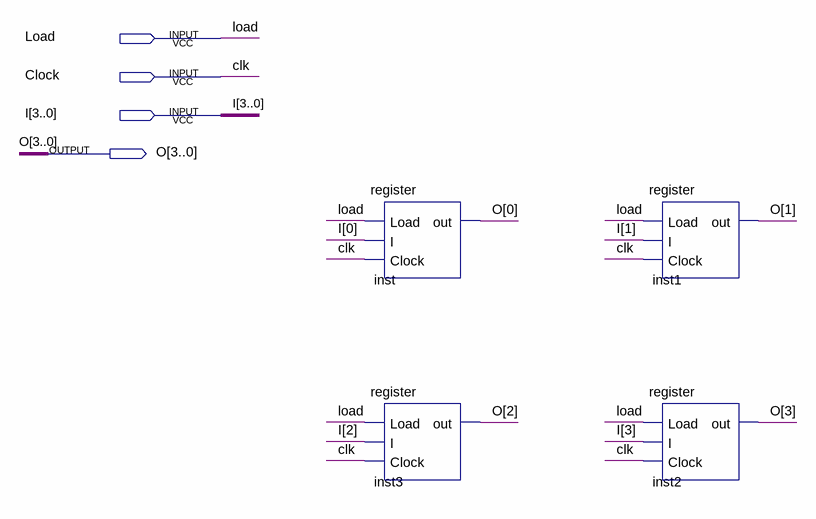
[diagram p0: schematic sheet]
// Quartus schematic register4bit.bdf as structural Verilog: 4 symbols, 4 pins
module register4bit (
  input  Load,
  input  Clock,
  input  [3:0] I,
  output [3:0] O
);

  register inst (.Load(Load), .I(I[0]), .Clock(Clock), .out(O[0]));
  register inst3 (.Load(Load), .I(I[2]), .Clock(Clock), .out(O[2]));
  register inst1 (.Load(Load), .I(I[1]), .Clock(Clock), .out(O[1]));
  register inst2 (.Load(Load), .I(I[3]), .Clock(Clock), .out(O[3]));

  // Other names for the same wires on the sheet: clk = Clock
endmodule
